# EAGLE design Slave (EAGLE 8.2.2)
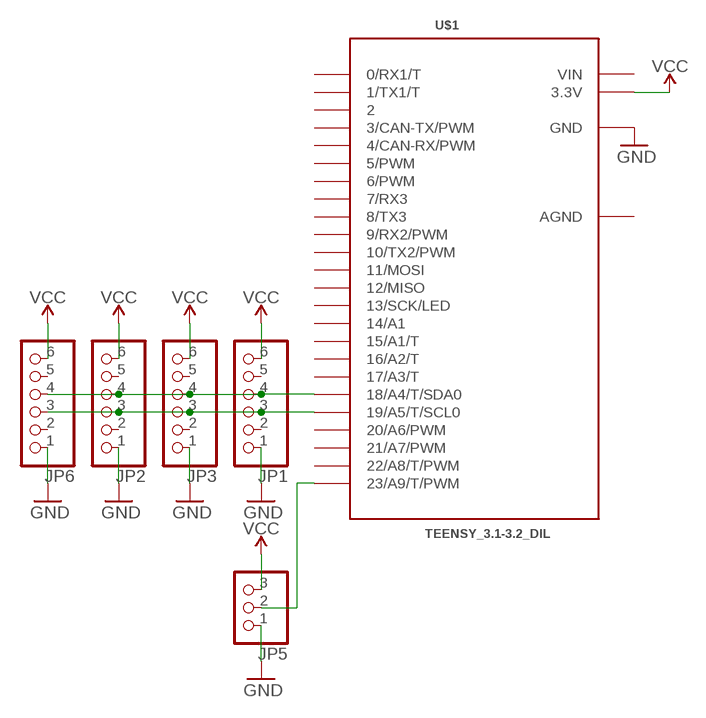
[diagram p0: schematic, sheet 1]

## Parts
JP1  PINHD-1X6  [1X06]
JP2  PINHD-1X6/90  [1X06/90]
JP3  PINHD-1X6/90  [1X06/90]
JP5  PINHD-1X3  [1X03]
JP6  PINHD-1X6/90  [1X06/90]
U$1  TEENSY_3.1-3.2_DIL  [TEENSY_3.0-3.2&LC_DIL]

## Nets
GND: JP1.1 JP2.1 JP3.1 JP5.1 JP6.1 U$1.GND
N$1: JP5.2 U$1.23/A9(23/A9/T/PWM)
N$2: JP1.3 JP2.3 JP3.3 JP6.3 U$1.19/A5(19/A5/T/SCL0)
N$3: JP1.4 JP2.4 JP3.4 JP6.4 U$1.18/A4(18/A4/T/SDA0)
VCC: JP1.6 JP2.6 JP3.6 JP5.3 JP6.6 U$1.3.3V
Unconnected: JP1.2 JP1.5 JP2.2 JP2.5 JP3.2 JP3.5 JP6.2 JP6.5 U$1.0(0/RX1/T) U$1.1(1/TX1/T) U$1.2 U$1.3(3/CAN-TX/PWM) U$1.4(4/CAN-RX/PWM) U$1.5(5/PWM) U$1.6(6/PWM) U$1.7(7/RX3) U$1.8(8/TX3) U$1.9(9/RX2/PWM) U$1.10(10/TX2/PWM) U$1.11(11/MOSI) U$1.12(12/MISO) U$1.13(13/SCK/LED) U$1.14/A0(14/A1) U$1.15/A1(15/A1/T) U$1.16/A2(16/A2/T) U$1.17/A3(17/A3/T) U$1.20/A6(20/A6/PWM) U$1.21/A7(21/A7/PWM) U$1.22/A8(22/A8/T/PWM)

## Power pins joined to a net without a drawn wire
AGND: U$1.AGND
VIN: U$1.VIN

## Library data of the parts
JP1-JP3 JP6 = pinhead:PINHD-1X6: PIN HEADER
JP5 = pinhead:PINHD-1X3: PIN HEADER
U$1 = Teensy_3_and_LC_Series_Boards_v1.4:TEENSY_3.1-3.2_DIL: Teensy 3.1 or 3.2 in a DIL Layout.

## Board
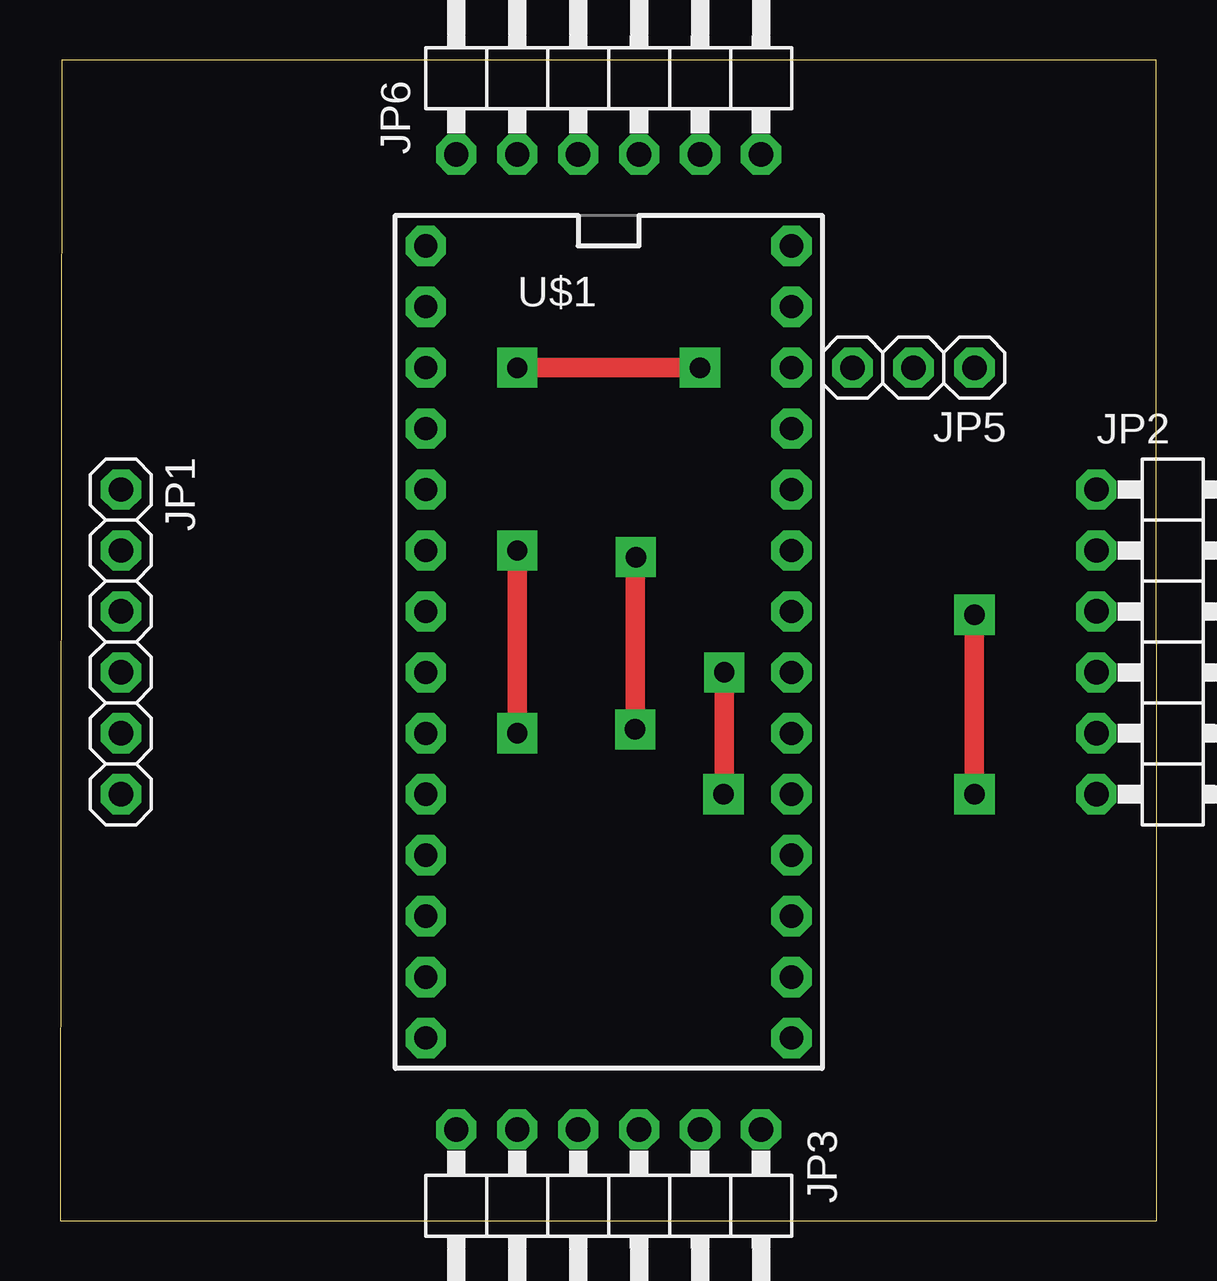
[diagram p1: board, top side]
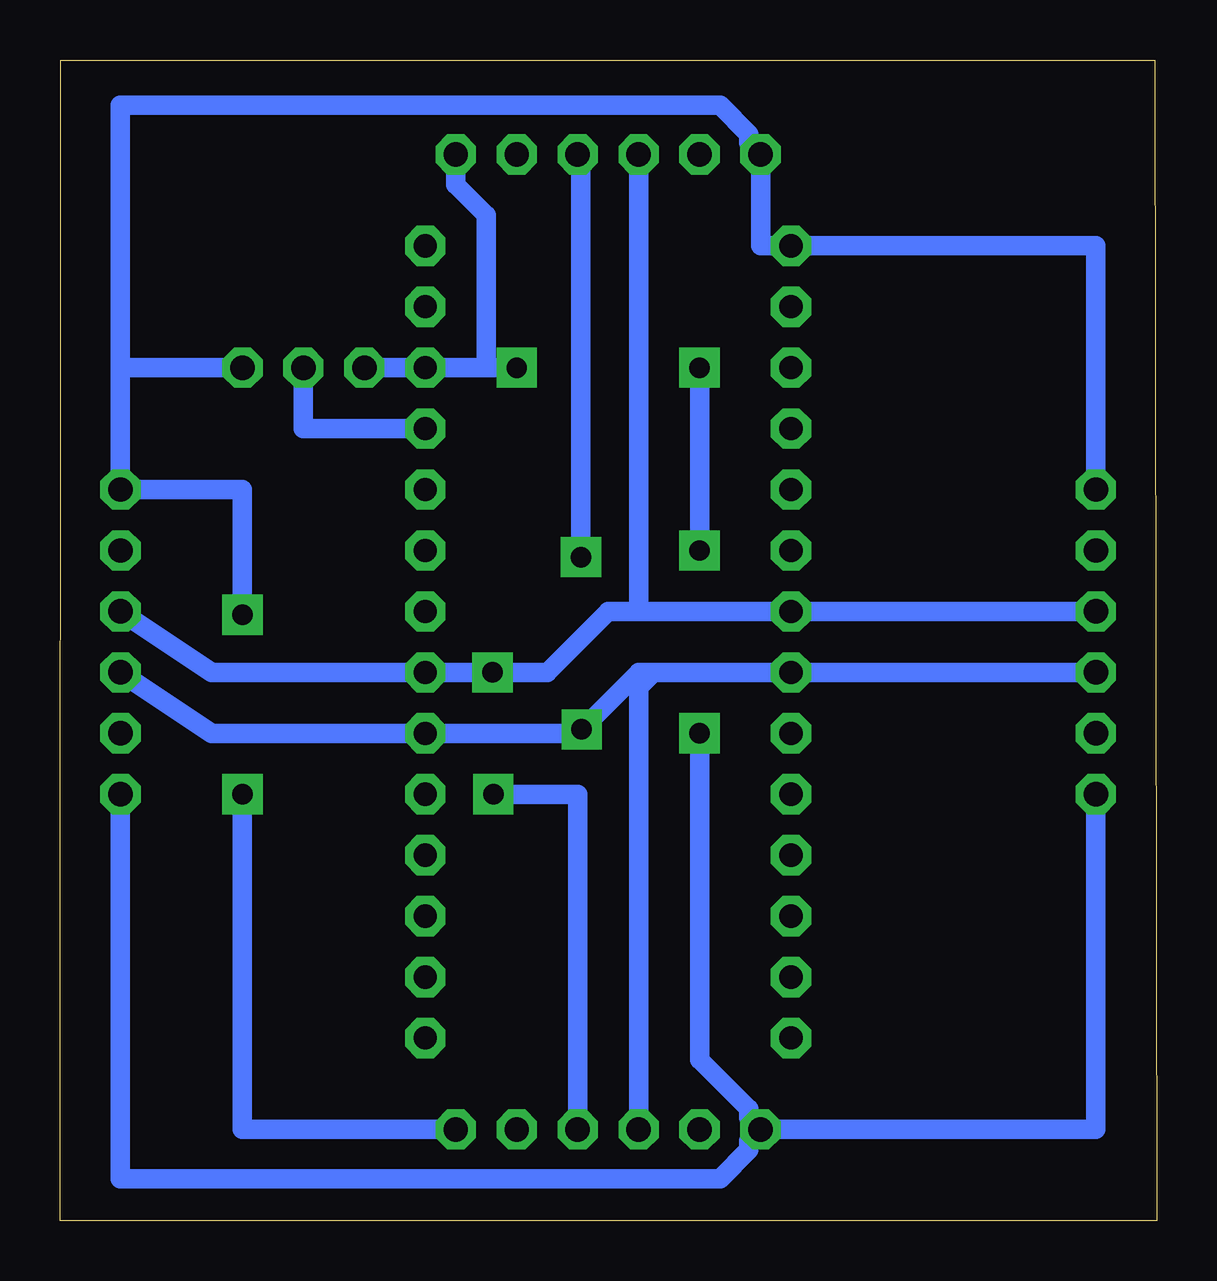
[diagram p2: board, bottom side, seen from below]

Size 45.7 x 48.39 mm. Coordinates in mm from the lower left corner, seen from the top.
Outline: 0,0 45.7,0 45.67,48.37 0.08,48.39 0,0
Copper layers (1*16): Top 0.035mm / dielectric 1.5mm / Bottom 0.035mm
Design rules "default *": minimum track width 32mil, minimum drill 0.35mm, track to track 32mil, track to pad 32mil, pad to pad 32mil, via to via 32mil, smd to smd 32mil, copper to edge 40mil, drill to drill 6mil, minimum pad ring 10mil, minimum via ring 8mil, stop-mask expansion 4mil, vias tented up to drill 0mil, thermal gap 10mil

### Footprints (pad centres in the part's own frame; a part is rotated, then mirrored left to right if it is on the bottom)
1X06 = drill 1.016 pad 1.676 octagon: 1 -6.35,0; 2 -3.81,0; 3 -1.27,0; 4 1.27,0; 5 3.81,0; 6 6.35,0
1X06/90 = drill 1.016 pad 1.676 octagon: 1 -6.35,-3.81; 2 -3.81,-3.81; 3 -1.27,-3.81; 4 1.27,-3.81; 5 3.81,-3.81; 6 6.35,-3.81
1X03 = drill 1.016 pad 1.676 octagon: 1 -2.54,0; 2 0,0; 3 2.54,0
TEENSY_3.0-3.2&LC_DIL = drill 0.965 pad 1.676 octagon: 0 -7.62,13.97; 1 -7.62,11.43; 2 -7.62,8.89; 3 -7.62,6.35; 3.3V 7.62,11.43; 4 -7.62,3.81; 5 -7.62,1.27; 6 -7.62,-1.27; 7 -7.62,-3.81; 8 -7.62,-6.35; 9 -7.62,-8.89; 10 -7.62,-11.43; 11 -7.62,-13.97; 12 -7.62,-16.51; 13 7.62,-16.51; 14/A0 7.62,-13.97; 15/A1 7.62,-11.43; 16/A2 7.62,-8.89; 17/A3 7.62,-6.35; 18/A4 7.62,-3.81; 19/A5 7.62,-1.27; 20/A6 7.62,1.27; 21/A7 7.62,3.81; 22/A8 7.62,6.35; 23/A9 7.62,8.89; AGND 7.62,13.97; GND -7.62,16.51; VIN 7.62,16.51

### Placement (x,y rotation side)
JP1  2.54,24.13 270 top
JP2  46.99,24.13 270 top
JP3  22.86,0 180 top
JP5  35.56,35.56 180 top
JP6  22.86,48.26 0 top
U$1  22.86,24.13 0 top

### Tracks (layer width: path | path; a pad name or v marks a point on that pad's centre or on a via)
GND  (via drill 0.85 pad 1.68)
  Top 0.813: v38.1,17.78 v38.1,25.27
  Bottom 0.813: JP1.1 2.54,40.64 U$1.GND 16.51,40.64 JP6.1 16.99,44.93 16.99,45.3 18.2,46.51 43.18,46.51 43.18,35.56 | 43.18,35.56 JP2.1 38.1,30.48 v38.1,25.27 | JP5.1 43.18,35.56 | v38.1,17.78 38.1,3.81 JP3.1
N$1
  Bottom 0.813: U$1.23/A9 35.56,33.02 JP5.2
N$2  (via drill 0.85 pad 1.68)
  Top 0.813: v27.64,17.78 27.68,17.78 v27.68,22.86
  Bottom 0.813: JP2.3 39.37,22.86 U$1.19/A5 v27.68,22.86 25.4,22.86 22.86,25.4 21.6,25.4 | 21.6,25.4 JP1.3 | JP6.3 21.59,25.41 21.6,25.4 | JP3.3 24.13,17.78 v27.64,17.78
N$3  (via drill 0.85 pad 1.68)
  Top 0.813: v24,27.67 23.96,27.67 v23.96,20.48
  Bottom 0.813: JP2.4 39.37,20.32 U$1.18/A4 24.13,20.32 v23.96,20.48 21.59,22.86 20.96,22.86 | 20.96,22.86 JP1.4 | 20.96,22.86 21.59,22.23 JP3.4 | JP6.4 24,44.45 v24,27.67
VCC  (via drill 0.85 pad 1.68)
  Top 0.813: v19.05,20.32 v19.05,27.94 | v19.05,35.56 v26.67,35.56
  Bottom 0.813: 27.94,35.56 27.94,41.91 29.21,43.18 JP6.6 | 27.94,35.56 U$1.3.3V JP5.3 | JP1.6 2.54,3.81 JP3.6 | JP3.6 16.99,3.33 16.99,2.96 18.2,1.75 43.18,1.75 JP2.6 | JP3.6 16.99,4.29 16.99,4.66 19.05,6.72 v19.05,20.32 | v19.05,27.94 v19.05,35.56 | v26.67,35.56 27.94,35.56